# Altium schematic sheet IMD_project.SchDoc: IMD
size A4; Author: FSAE MotorSport UTN; Revision: 1.0; SheetNumber: 1; SheetTotal: 1
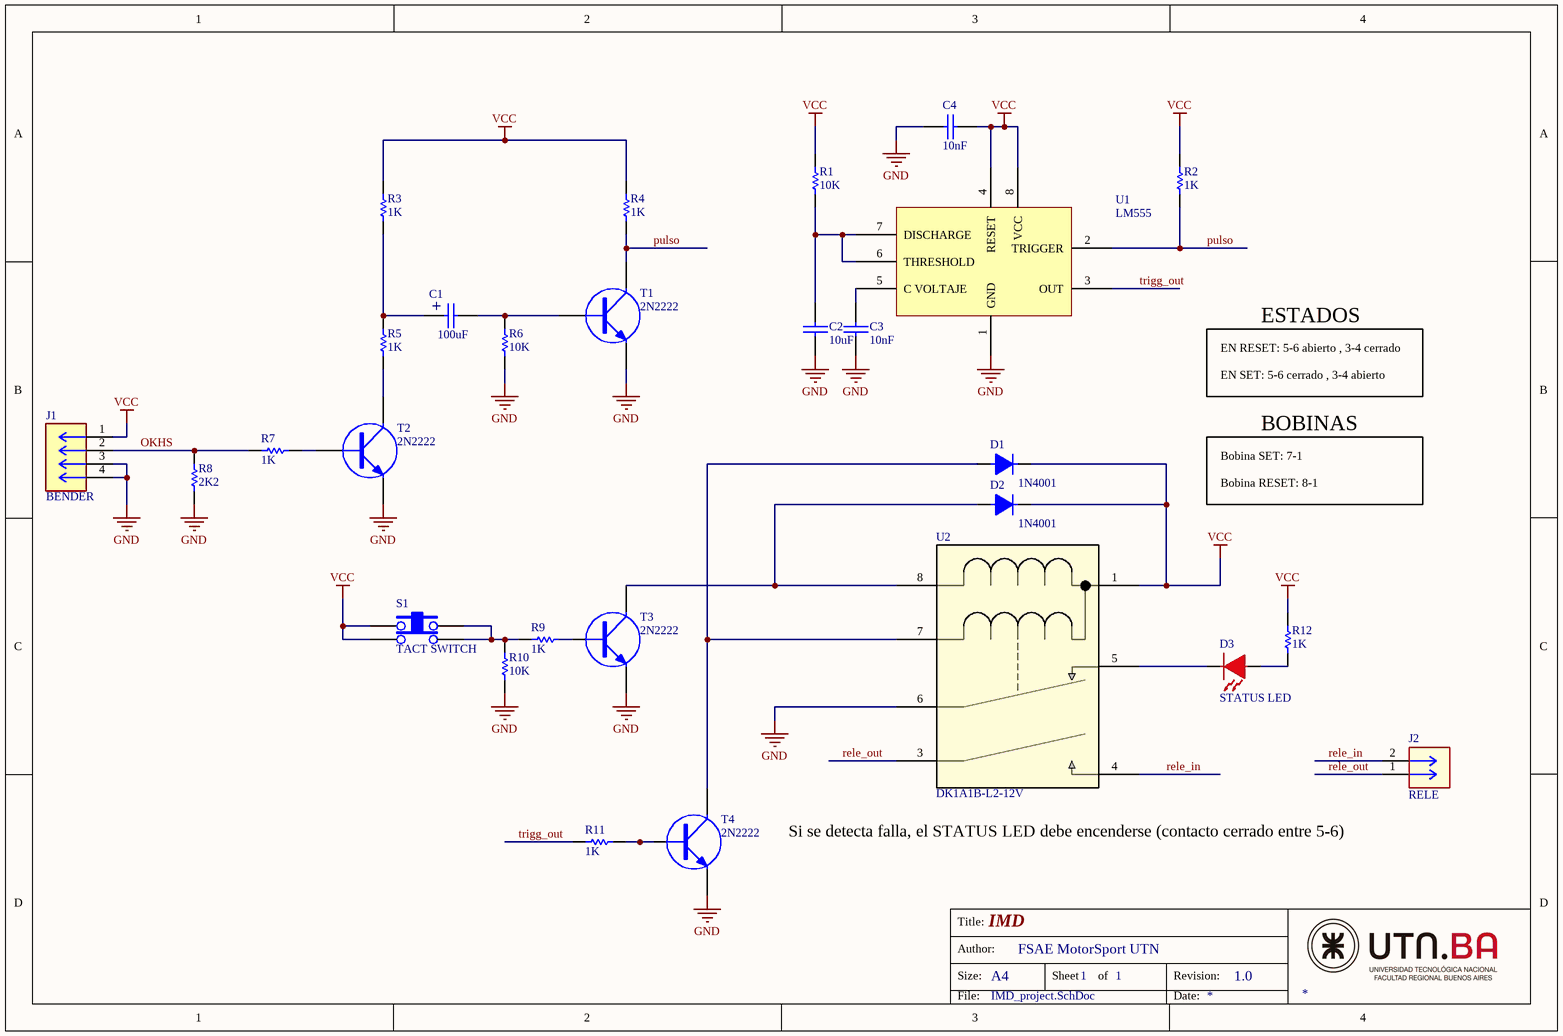
[diagram p0: IMD_project.SchDoc]

## Parts
C1  100uF  [CAP300RP]
C2  10uF  [CAP200]
C3  10nF  [CAP200]
C4  10nF  [CAP200]
D1  1N4001  [DO41]
D2  1N4001  [DO41]
D3  STATUS LED  [LED 3 - Red]
J1  BENDER  [CONN_SD-44067-001_04_MOL]
J2  RELE  [CONN_SD-44067-001_02_MOL]
R1  10K  [RES400]
R2  1K  [RES400]
R3  1K  [RES400]
R4  1K  [RES400]
R5  1K  [RES400]
R6  10K  [RES400]
R7  1K  [RES400]
R8  2K2  [RES400]
R9  1K  [RES400]
R10  10K  [RES400]
R11  1K  [RES400]
R12  1K  [RES400]
S1  TACT SWITCH  [TACTSWITCH]
T1  2N2222  [TO-18]
T2  2N2222  [TO-18]
T3  2N2222  [TO-18]
T4  2N2222  [TO-18]
U1  LM555  [DIP8]
U2  DK1A1B-L2-12V  [RELAY_DK2A_L2_PAN]

## Nets
GND: C2.2 C3.2 C4.2 J1.3 J1.4 R6.1 R8.1 R10.2 T1.3(E) T2.3(E) T3.3(E) T4.3(E) U1.1(GND) U2.6
VCC: C4.1 D1.2 D2.2 J1.1 R1.2 R2.2 R3.2 R4.2 R12.2 S1.1 S1.2 U1.4(RESET) U1.8(VCC) U2.1
OKHS: J1.2 R7.2 R8.2
pulso: R2.1 R4.1 T1.2(C) U1.2(TRIGGER)
rele_in: J2.2 U2.4
rele_out: J2.1 U2.3
trigg_out: R11.2 U1.3(OUT)
NetC1_1: C1.1 R3.1 R5.2
NetC1_2: C1.2 R6.2 T1.1(B)
NetC2_1: C2.1 R1.1 U1.6(THRESHOLD) U1.7(DISCHARGE)
NetC3_1: C3.1 U1.5(C_VOLTAJE)
NetD1_1: D1.1 T4.2(C) U2.7
NetD2_1: D2.1 T3.2(C) U2.8
NetD3_1: D3.1 R12.1
NetD3_2: D3.2 U2.5
NetR5_1: R5.1 T2.2(C)
NetR7_1: R7.1 T2.1(B)
NetR9_1: R9.1 T3.1(B)
NetR9_2: R9.2 R10.1 S1.3 S1.4
NetR11_1: R11.1 T4.1(B)

## Notes on the sheet
- EN RESET: 5-6 abierto , 3-4 cerrado
- EN SET: 5-6 cerrado , 3-4 abierto
- ESTADOS
- BOBINAS
- Bobina SET: 7-1
- Bobina RESET: 8-1
- Si se detecta falla, el STATUS LED debe encenderse (contacto cerrado entre 5-6)
- Title:
- Size:
- Author:
- A4
- Sheet
- of
- Revision:
- File:
- Date:
- (in symbol CAPPOL) +

## Library data of the parts
C1 = CAPPOL
C2-C4 = CAP
D1 D2 = 1N4001: Diodo
D3 = LED ROJO
J1 = MolexMini 4: Molex mini 40 de 4 pines (347920040); Package: None; Price: None; Value: *; MP: 347920040; Availability: Unavailable
J2 = MolexMini 2: Micro-Fit 3.0 Wire-to-Board Header, Dual Row, Vertical for up to 3.56mm Thick PCB, 2 Circuits, Tin (Sn) Plating; Manufacturer_Name: Molex Connector Corporation; Manufacturer_Part_Number: 440670201; Copyright: Copyright (C) 2025 Ultra Librarian. All rights reserved.; RefDes: RefDes; Type: Type
R1-R12 = RES
T1-T4 = TRANSISTOR NPN
U1 = LM555: Timer
U2 = DK1A1B-L2-12V: Description; Manufacturer_Name: Panasonic; Copyright: Copyright (C) 2026 Ultra Librarian. All rights reserved.; Manufacturer_Part_Number: DK1A1B-L2-12V; RefDes: RefDes; Type: Type